# EasyEDA schematic 1-Schematic_Envelope Follower Rev 3 PCB.json

## Sheets
1 Main_Board: TITLE: Envelope Follower > Main Board; REV: 3; Date: December 2021; Sheet: 1/2; Company: Bumm Bumm Garage
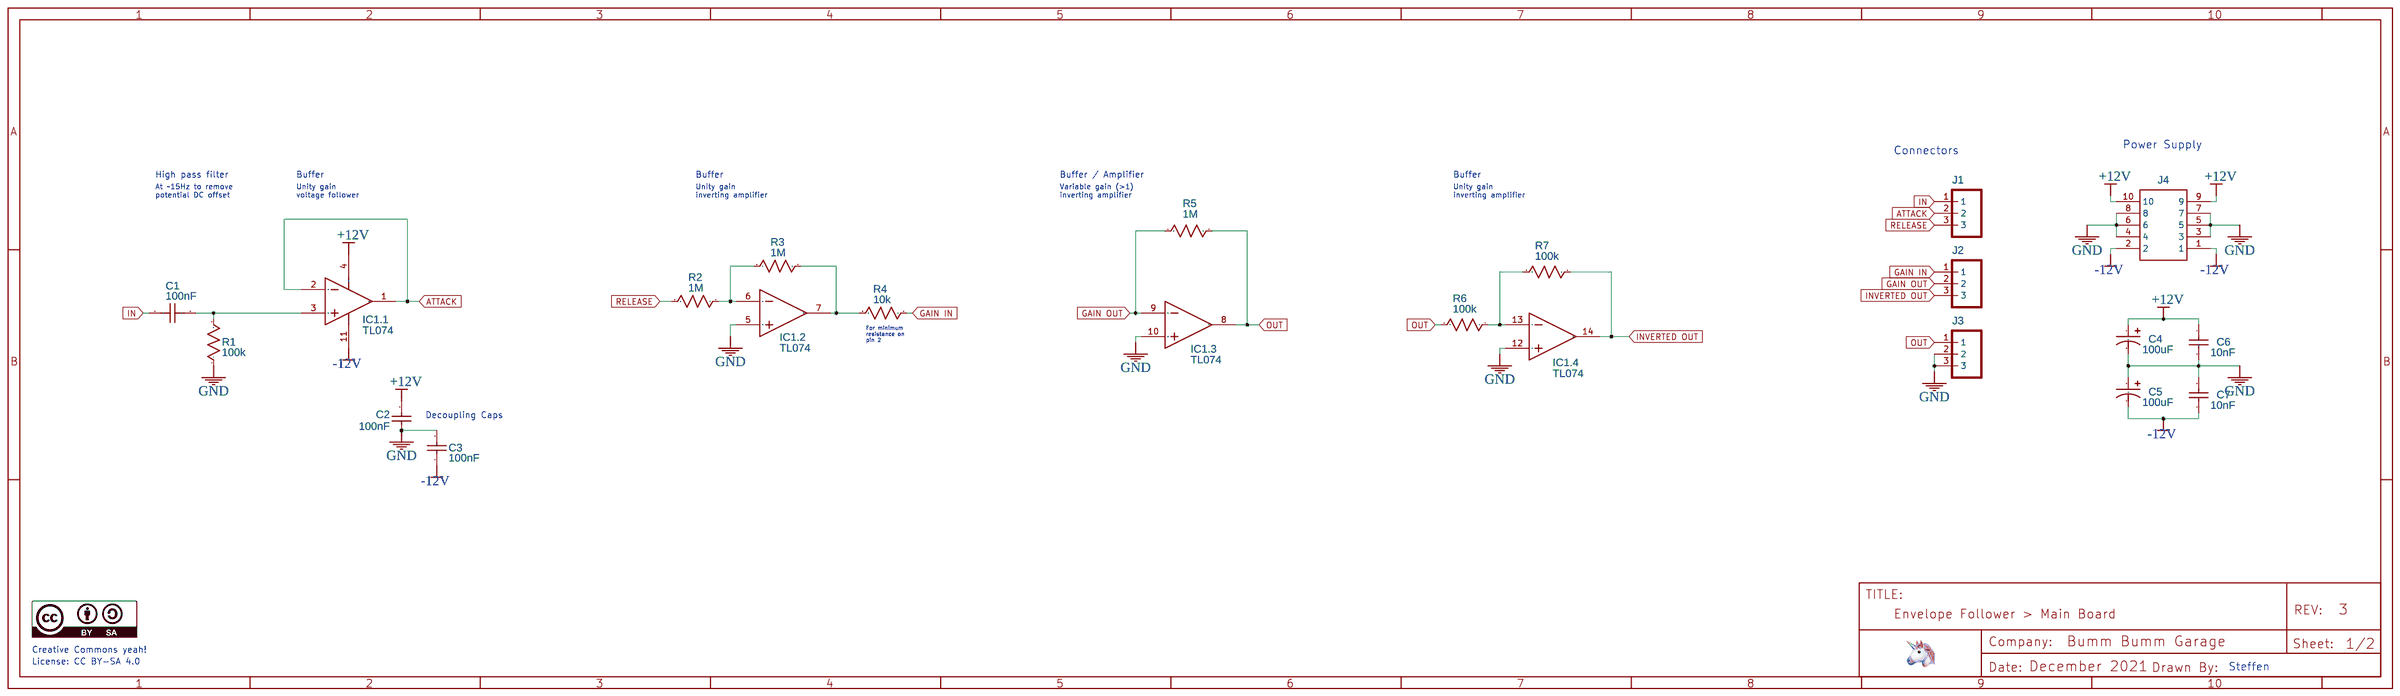
[diagram p0: Main_Board]
2 Control_Board: TITLE: Envelope Follower > Control Board; Sheet: 2/2
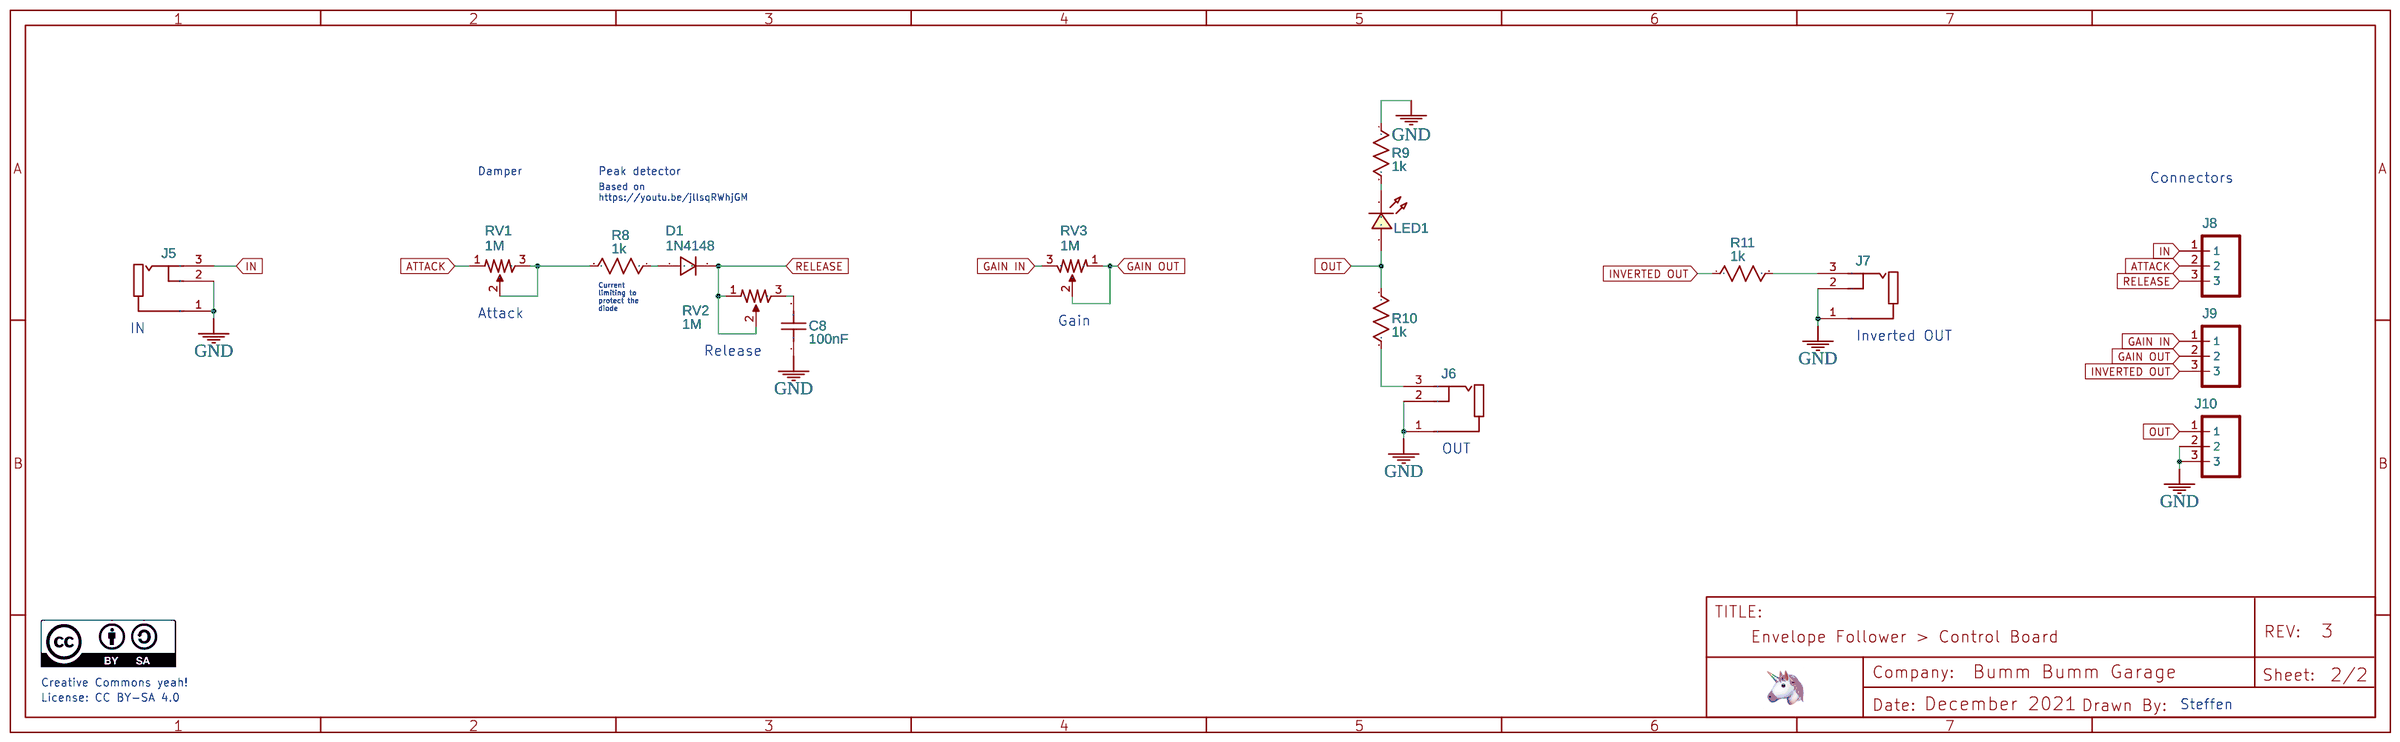
[diagram p1: Control_Board]

## Parts
sheet Control_Board
C8  100nF  [CAPACITOR]
D1  1N4148  [DIODE]
J5  Jack Socket Thonkiconn Mono 3 Pin  [JACK SOCKET THONKICONN]
J6  Jack Socket Thonkiconn Mono 3 Pin  [JACK SOCKET THONKICONN]
J7  Jack Socket Thonkiconn Mono 3 Pin  [JACK SOCKET THONKICONN]
J8  CONNECTOR 1X3 PIN  [CONNECTOR 1X3 PIN]
J9  CONNECTOR 1X3 PIN  [CONNECTOR 1X3 PIN]
J10  CONNECTOR 1X3 PIN  [CONNECTOR 1X3 PIN]
LED1  LED-0603_G  [LED 3MM TOP]
R8  1k  [RESISTOR]
R9  1k  [RESISTOR]
R10  1k  [RESISTOR]
R11  1k  [RESISTOR]
RV1  1M  [ALPS POTI STEHEND 2HP]
RV2  1M  [ALPS POTI STEHEND 2HP]
RV3  1M  [ALPS POTI STEHEND 2HP]
sheet Main_Board
C1  100nF  [CAPACITOR]
C2  100nF  [CAPACITOR]
C3  100nF  [CAPACITOR]
C4  100uF  [CAPACITOR ELECTROLYTIC LIEGEND]
C5  100uF  [CAPACITOR ELECTROLYTIC LIEGEND]
C6  10nF  [CAPACITOR]
C7  10nF  [CAPACITOR]
IC1  TL074  [INTEGRATED CIRCUIT 14 PIN]  (sections 1,2,3,4)
J1  CONNECTOR 1X3 PIN  [CONNECTOR 1X3 PIN]
J2  CONNECTOR 1X3 PIN  [CONNECTOR 1X3 PIN]
J3  CONNECTOR 1X3 PIN  [CONNECTOR 1X3 PIN]
J4  Box Header, 10 Pin  [BOX HEADER 2X5 EURORACK POWER 10 PIN]
R1  100k  [RESISTOR]
R2  1M  [RESISTOR]
R3  1M  [RESISTOR]
R4  10k  [RESISTOR]
R5  1M  [RESISTOR]
R6  100k  [RESISTOR]
R7  100k  [RESISTOR]

## Library data of the parts
C1 C8 = C_0603_US: Contributor: LCEDA_Lib
D1 = 1N4148: Supplier: LCSC; Manufacturer: SEMTECH; Supplier Part: C14516; Contributor: LCEDA_Lib
J5-J7 = Jack Socket Thonkiconn Mono 3 Pin: Supplier: Reichelt; link: https://www.reichelt.de/de/en/jack-panel-socket-3-5-mm-mono-break-contact-pcb-lum-1502-03-p116176.html; Contributor: Bumm Bumm Garage
J1-J3 J8-J10 = CONNECTOR 1X3 PIN: Header 6; Contributor: Bumm Bumm Garage
LED1 = LED-0603_G: Manufacturer: EVERLIGHT(台湾亿光); Manufacturer Part: 19-217/GHC-YR1S2/3T; Supplier Part: C72043; Supplier: LCSC; Contributor: LCEDA_Lib
R1-R11 = R_0603_US: Contributor: LCEDA_Lib
RV1-RV3 = Potentiometer, linear, Lötanschluss: Model: Potentiometer; K(%): 50; Contributor: ufyniqds; Package Display: No
C2 C3 C6 C7 = 0.22uF 5% 100VCalibration capacitor: Supplier Part: undefined; Supplier: LCSC; Manufacturer: ReliaPro
C4 C5 = Capacitor Polarized: POLARIZED CAPACITOR, American symbol; Contributor: ufyniqds
IC1 = TL074IDT: Supplier Part: C107644; Supplier: LCSC; Manufacturer Part: STMicroelectronics; subpart_no: 1; JLCPCB Part Class: Extended Part
J4 = Box Header, 10 Pin: Contributor: ufyniqds

## Nets
+12V: C2.2 C4.1 C6.1 IC1.4(VCC+) J4.9 J4.10
-12V: C3.1 C5.2 C7.2 IC1.11(VCC-) J4.1 J4.2
GND: C2.1 C3.2 C4.2 C5.1 C6.2 C7.1 C8.1 IC1.5(2IN+) IC1.10(3IN+) IC1.12(4IN+) J3.2 J3.3 J4.3 J4.4 J4.5 J4.6 J4.7 J4.8 J5.1 J5.2 J6.1 J6.2 J7.1 J7.2 J10.2 J10.3 R1.1 R9.1
ATTACK: IC1.1(1OUT) IC1.2(1IN-) J1.2 J8.2 RV1.1
GAIN IN: J2.1 J9.1 R4.1 RV3.3
GAIN OUT: IC1.9(3IN-) J2.2 J9.2 R5.2 RV3.1 RV3.2
IN: C1.1 J1.1 J5.3 J8.1
INVERTED OUT: IC1.14(4OUT) J2.3 J9.3 R7.1 R11.1
OUT: IC1.8(3OUT) J3.1 J10.1 LED1.1 R5.1 R6.2 R10.1
RELEASE: D1.2 J1.3 J8.3 R2.2 RV2.1 RV2.2
Net-(C1-2): C1.2 IC1.3(1IN+) R1.2
Net-(C8-2): C8.2 RV2.3
Net-(D1-1): D1.1 R8.1
Net-(IC1.2-6): IC1.6(2IN-) R2.1 R3.2
Net-(IC1.2-7): IC1.7(2OUT) R3.1 R4.2
Net-(IC1.4-13): IC1.13(4IN-) R6.1 R7.2
Net-(J6-3): J6.3 R10.2
Net-(J7-3): J7.3 R11.2
Net-(LED1-2): LED1.2 R9.2
Net-(R8-2): R8.2 RV1.2 RV1.3

## Notes on the sheets
sheet 1
- Connectors
- Power Supply
- High pass filter
- Buffer
- Buffer
- Buffer / Amplifier
- Buffer
- At ~15Hz to remove
  potential DC offset
- Unity gain
  voltage follower
- Unity gain
  inverting amplifier
- Variable gain (>1)
  inverting amplifier
- Unity gain
  inverting amplifier
- For minimum
  resistance on
  pin 2
- Decoupling Caps
- Creative Commons yeah!
- License: CC BY-SA 4.0
- Steffen
sheet 2
- Damper
- Peak detector
- Connectors
- Based on
  https://youtu.be/jllsqRWhjGM
- Current
  limiting to
  protect the
  diode
- Attack
- Gain
- IN
- Inverted OUT
- Release
- OUT
- Creative Commons yeah!
- License: CC BY-SA 4.0
- Steffen
